# EAGLE design ColorNodeV1 (EAGLE 5.11)
ABBREV: jn5; PROJECT: JeeNode v5
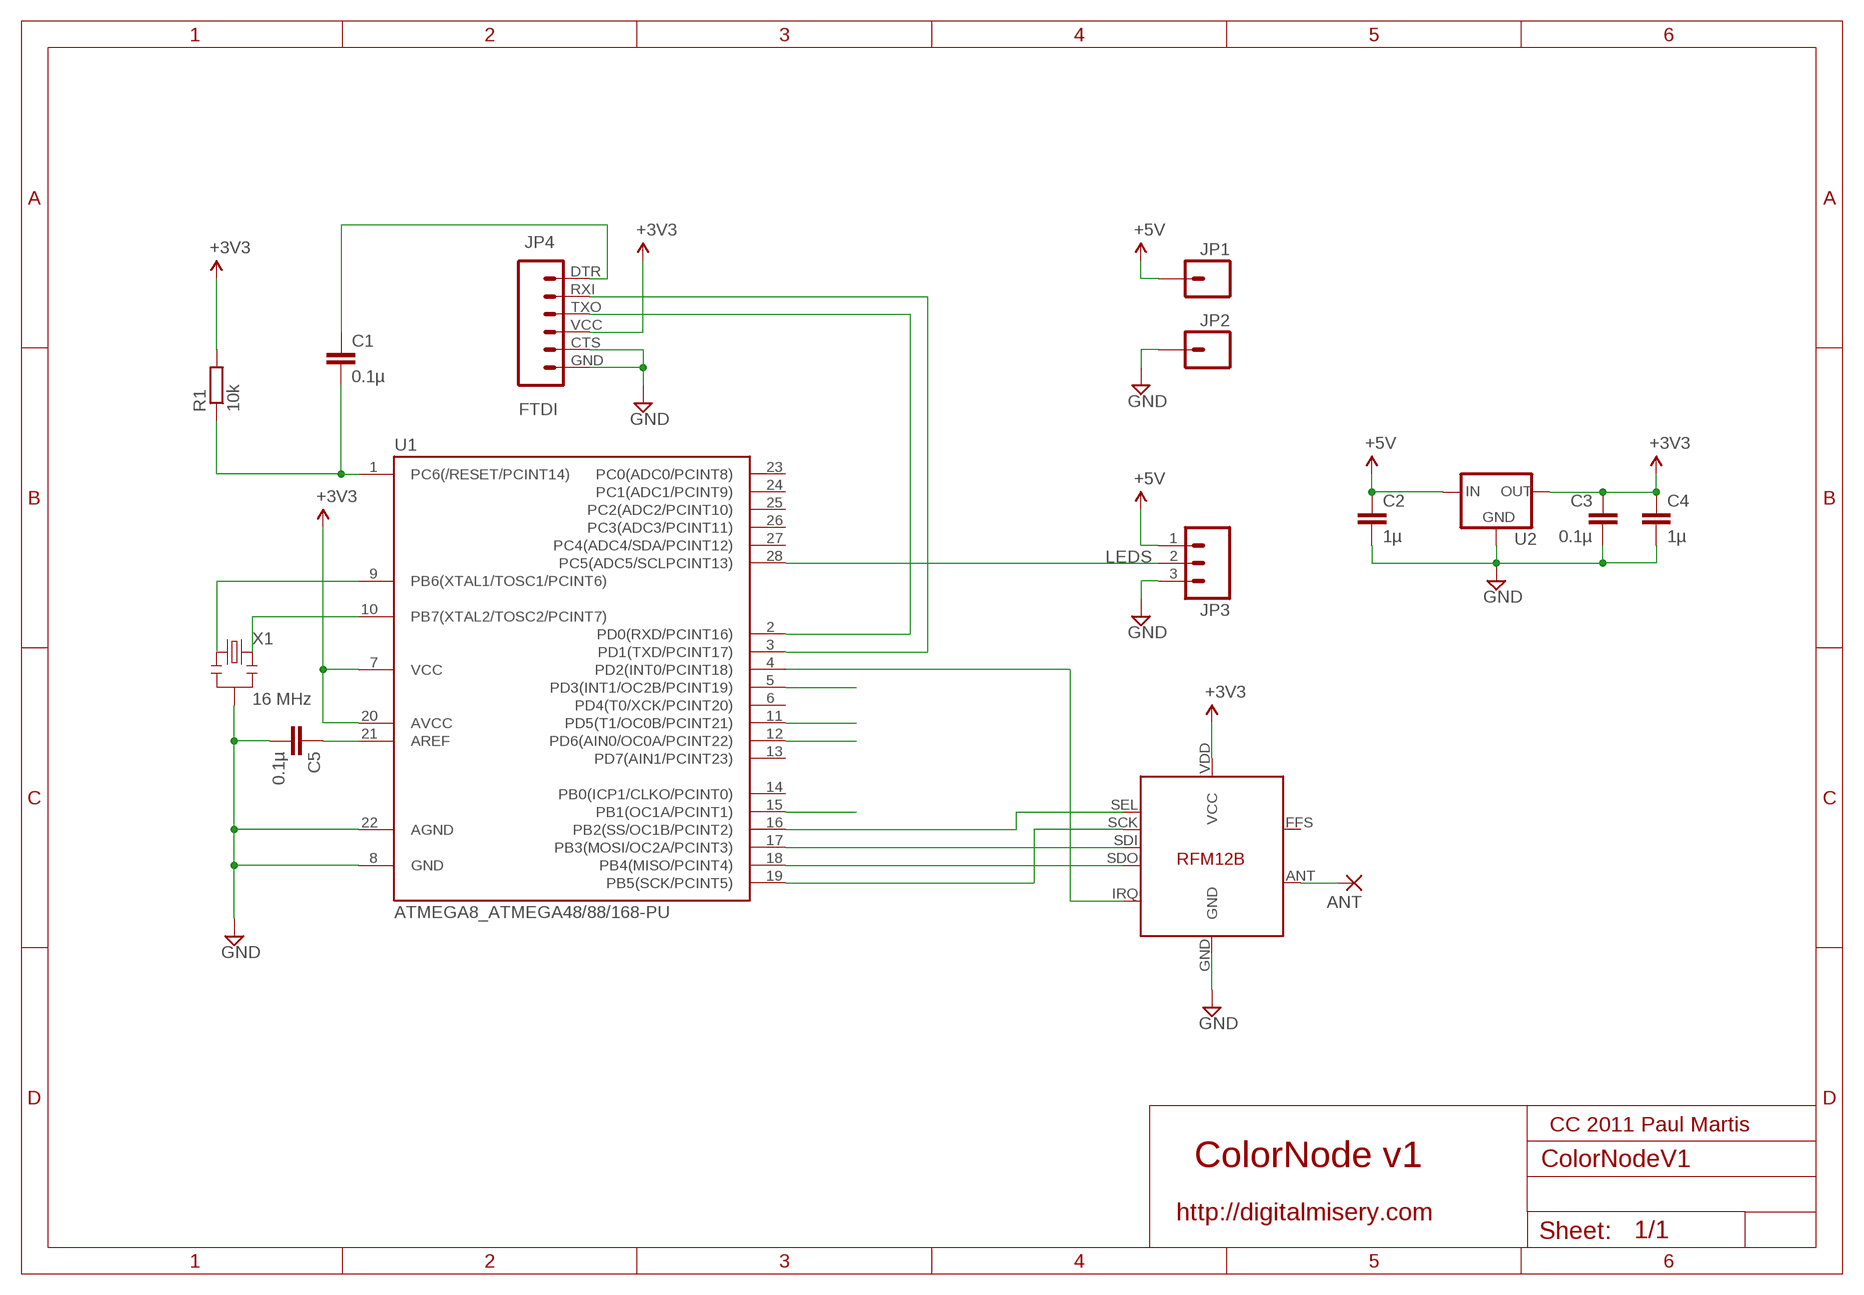
[diagram p0: schematic, sheet 1]

## Parts
ANT  1,6/0,8  [1,6/0,8]
C1  0.1µ  C-EU025-024X044  [C025-024X044]
C2  1µ  C-EU025-024X044  [C025-024X044]
C3  0.1µ  C-EU025-024X044  [C025-024X044]
C4  1µ  C-EU025-024X044  [C025-024X044]
C5  0.1µ  C-EU025-024X044  [C025-024X044]
JP1  M01PTH_2MM  [1X01_2MM]
JP2  M01PTH_2MM  [1X01_2MM]
JP3  M031X03_NO_SILK  [1X03_NO_SILK]
JP4  FTDI  FTDI_BASICPTH  [FTDI_BASIC]
R1  10k  R-EU_0204/7  [0204/7]
U1  ATMEGA8_ATMEGA48/88/168-PU  [ATMEGA8_DIL28-3]
U2  MCP1700INLINE  [TO92-INLINE]
U3  RFM12B  [RFM12B]
X1  16 MHz  RESONATORPTH  [RESONATOR-PTH]

## Nets
5V [power]: C2.1 JP1.1 JP3.1 U2.2(IN) ; supply symbol labelled +5V
GND [power]: C2.2 C3.2 C4.2 C5.2 JP2.1 JP3.3 JP4.CTS JP4.GND U1.8(GND) U1.22(AGND) U2.1(GND) U3.GND X1.2
LEDS: JP3.2 U1.28(PC5(ADC5/SCLPCINT13))
N$1: U1.9(PB6(XTAL1/TOSC1/PCINT6)) X1.1
N$2: C5.1 U1.21(AREF)
N$3: C1.1 JP4.DTR
N$4: U1.5(PD3(INT1/OC2B/PCINT19))
N$5: C1.2 R1.1 U1.1(PC6(/RESET/PCINT14))
N$6: JP4.TXO U1.2(PD0(RXD/PCINT16))
N$7: JP4.RXI U1.3(PD1(TXD/PCINT17))
N$8: U1.11(PD5(T1/OC0B/PCINT21))
N$9: U1.17(PB3(MOSI/OC2A/PCINT3)) U3.SDI
N$10: U1.4(PD2(INT0/PCINT18)) U3.IRQ
N$11: U1.18(PB4(MISO/PCINT4)) U3.SDO
N$12: U1.19(PB5(SCK/PCINT5)) U3.SCK
N$13: ANT.1(P) U3.ANT
N$14: U1.16(PB2(SS/OC1B/PCINT2)) U3.SEL
N$15: U1.12(PD6(AIN0/OC0A/PCINT22))
N$16: U1.15(PB1(OC1A/PCINT1))
N$21: U1.10(PB7(XTAL2/TOSC2/PCINT7)) X1.3
VCC [power]: C3.1 C4.1 JP4.VCC R1.2 U1.7(VCC) U1.20(AVCC) U2.3(OUT) U3.VDD(VCC) ; supply symbol labelled +3V3
Unconnected: U1.6(PD4(T0/XCK/PCINT20)) U1.13(PD7(AIN1/PCINT23)) U1.14(PB0(ICP1/CLKO/PCINT0)) U1.23(PC0(ADC0/PCINT8)) U1.24(PC1(ADC1/PCINT9)) U1.25(PC2(ADC2/PCINT10)) U1.26(PC3(ADC3/PCINT11)) U1.27(PC4(ADC4/SDA/PCINT12)) U3.FFS

## Notes on the sheet
- CC 2011 Paul Martis
- ColorNode v1
- http://digitalmisery.com

## Library data of the parts
ANT = JeeLabs:1,6/0,8: THROUGH-HOLE PAD
C1-C5 = resistor:C-EU: CAPACITOR, European symbol
JP1 JP2 = SparkFun:M01: Header 1 Standard 1-pin 0.1" header. Use with straight break away headers (SKU : PRT-00116), right angle break away headers (PRT-00553), swiss pins (PRT-00743), machine pins (PRT-00117), and female headers (PRT-00115).
JP3 = SparkFun:M03: Header 3 Standard 3-pin 0.1" header. Use with straight break away headers (SKU : PRT-00116), right angle break away headers (PRT-00553), swiss pins (PRT-00743), machine pins (PRT-00117), and female headers (PRT-00115). Molex polarized connector foot print use with SKU : PRT-08232 with associated crimp pins and housings.
JP4 = SparkFun:FTDI_BASIC: FTDI Basic: 3.3V and 5V
R1 = resistor:R-EU_: RESISTOR, European symbol
U1 = jlpcb-105:ATMEGA8_ATMEGA48/88/168-PU
U2 = adafruit:MCP1700: VOLTAGE REGULATOR
U3 = JeeLabs:RFM12B
X1 = SparkFun:RESONATOR: Resonator Small SMD resonator. This is the itty bitty 10/20MHz resonators with built in caps. CSTCE10M0G55 and CSTCE20M0V53. Footprint has been reviewed closely but hasn't been tested yet.

## Net classes
1 power: width 0.381 mm, clearance 0.254 mm

## Board
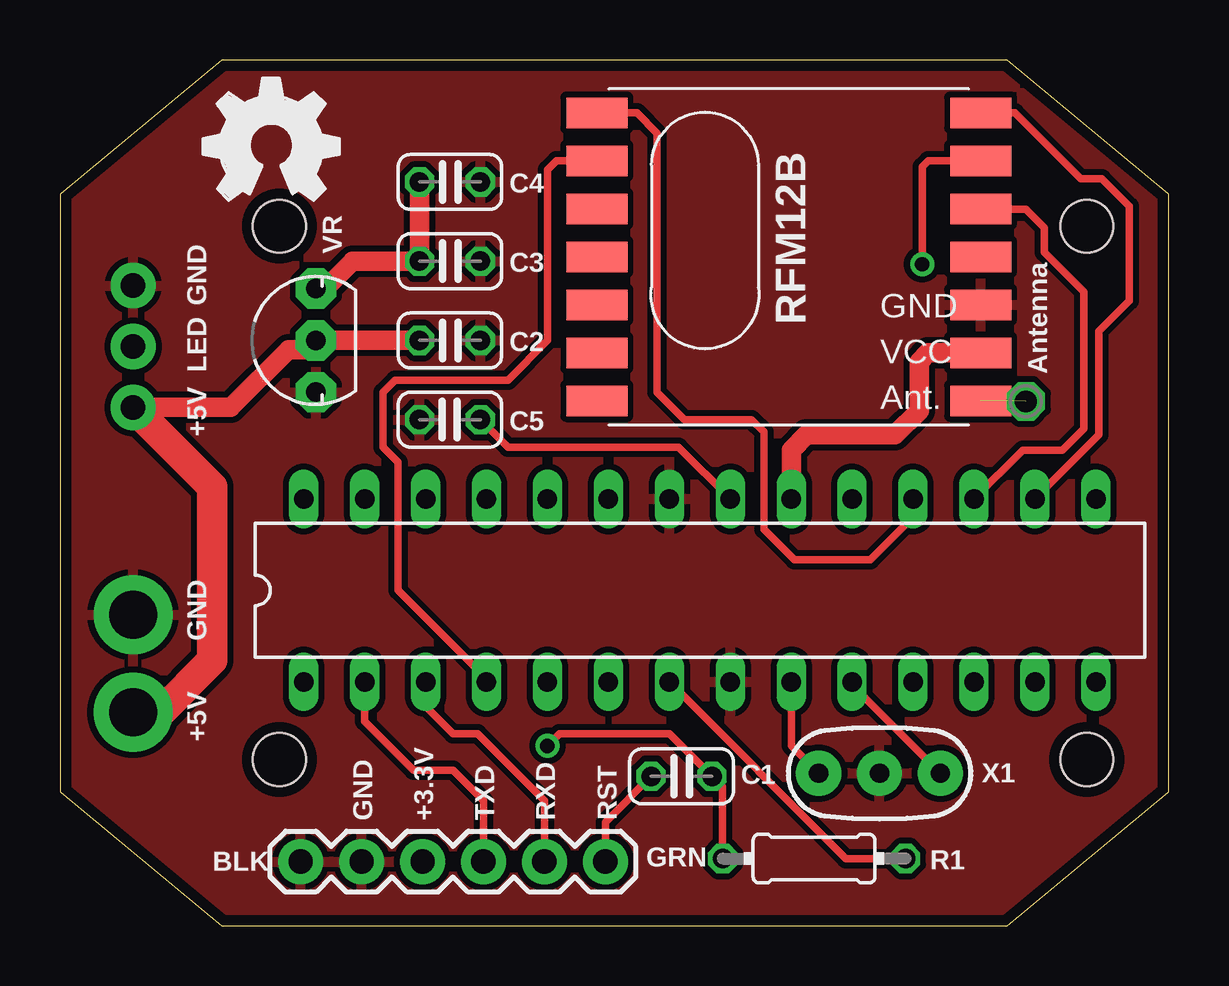
[diagram p1: board, top side]
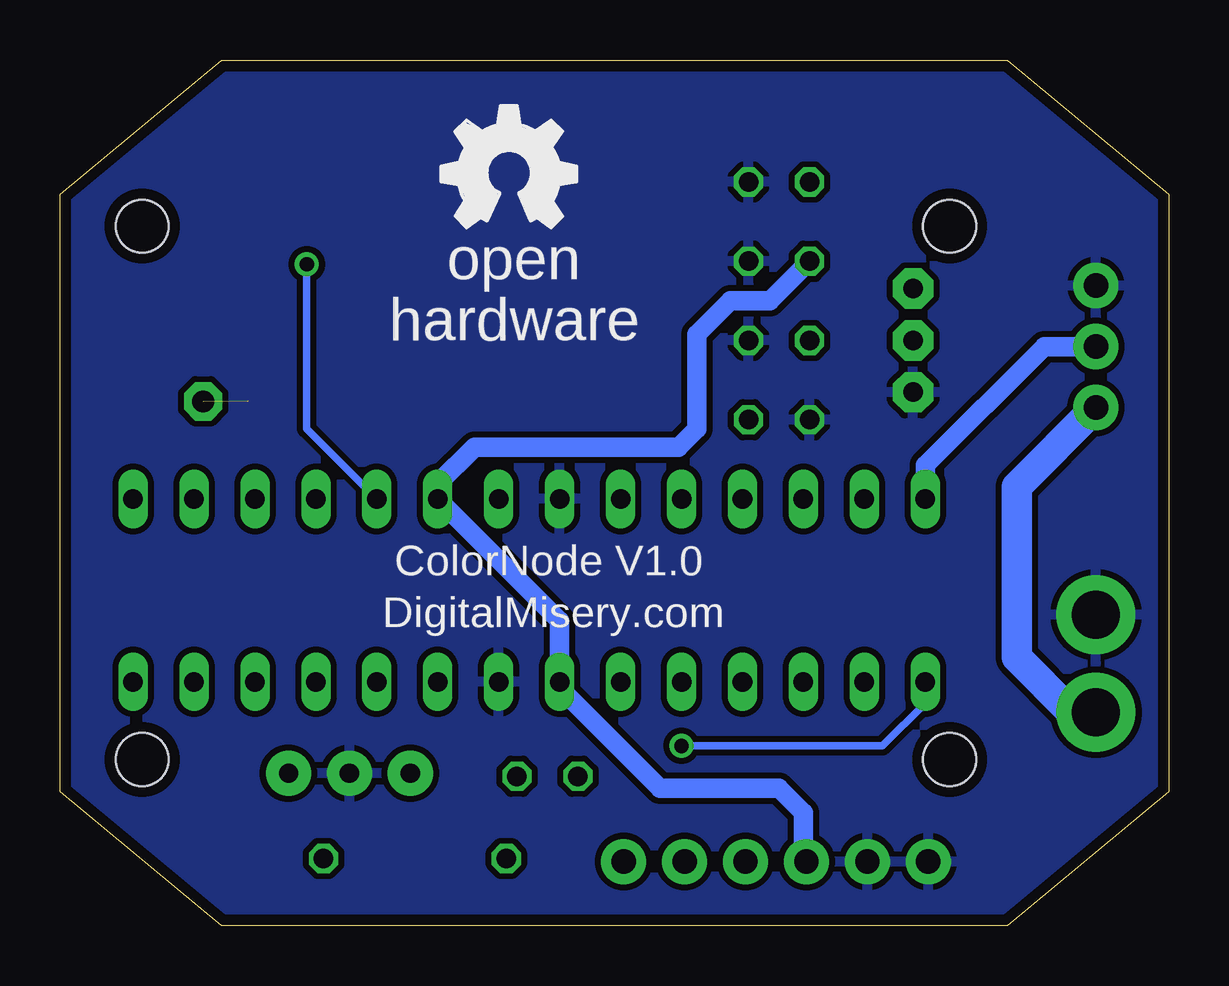
[diagram p2: board, bottom side, seen from below]

Size 46.23 x 36.07 mm. Coordinates in mm from the lower left corner, seen from the top.
Outline: 6.73,0 39.5,0 46.23,5.59 46.23,30.48 39.5,36.07 6.73,36.07 0,30.48 0,5.59 6.73,0
Copper layers (1*16): Top 0.035mm / dielectric 1.5mm / Bottom 0.035mm
Design rules "10mils *": minimum track width 8mil, minimum drill 0.4mm, track to track 8mil, track to pad 8mil, pad to pad 8mil, via to via 8mil, smd to smd 8mil, copper to edge 18mil, drill to drill 0.4mm, minimum pad ring 0.15mm, minimum via ring 8mil, stop-mask expansion 4mil, vias tented up to drill 20mil, thermal gap 10mil
Holes 2.2 mm at 9.14,29.15 9.14,6.92 42.8,6.92 42.8,29.15

### Footprints (pad centres in the part's own frame; a part is rotated, then mirrored left to right if it is on the bottom)
1,6/0,8 = drill 0.9 pad 1.6 octagon: 1 0,0
C025-024X044 = drill 0.813 octagon: 1 -1.27,0; 2 1.27,0
1X01_2MM = drill 2 pad 3.302 round: 1 0,0
1X03_NO_SILK = drill 1.016 pad 1.88 round: 1 0,0; 2 2.54,0; 3 5.08,0
FTDI_BASIC = drill 1.016 pad 1.88 round: CTS 10.16,0; DTR 0,0; GND 12.7,0; RXI 2.54,0; TXO 5.08,0; VCC 7.62,0
0204/7 = drill 0.813 octagon: 1 -3.81,0; 2 3.81,0
ATMEGA8_DIL28-3 = drill 0.813 long: 1 -16.51,-3.81; 2 -13.97,-3.81; 3 -11.43,-3.81; 4 -8.89,-3.81; 5 -6.35,-3.81; 6 -3.81,-3.81; 7 -1.27,-3.81; 8 1.27,-3.81; 9 3.81,-3.81; 10 6.35,-3.81; 11 8.89,-3.81; 12 11.43,-3.81; 13 13.97,-3.81; 14 16.51,-3.81; 15 16.51,3.81; 16 13.97,3.81; 17 11.43,3.81; 18 8.89,3.81; 19 6.35,3.81; 20 3.81,3.81; 21 1.27,3.81; 22 -1.27,3.81; 23 -3.81,3.81; 24 -6.35,3.81; 25 -8.89,3.81; 26 -11.43,3.81; 27 -13.97,3.81; 28 -16.51,3.81
TO92-INLINE = drill 0.813 pad 1.676 octagon: 1 -2.159,0; 2 0,0; 3 2.159,0
RFM12B = smd 2.54 x 1.27: ANT 8,-6; FFS -8,2; GND 8,-2; IRQ -8,4; P$8 -8,0; P$9 -8,-2; P$10 -8,-4; P$12 -8,-6; P$16 8,0; SCK 8,4; SDI 8,2; SDO -8,6; SEL 8,6; VDD 8,-4
RESONATOR-PTH = drill 0.8 pad 1.88 round: 1 -2.54,0; 2 0,0; 3 2.54,0

### Placement (x,y rotation side)
ANT  40.26,21.84 270 top
C1  25.91,6.22 0 top
C2  16.26,24.38 0 top
C3  16.26,27.69 0 top
C4  16.26,30.99 0 top
C5  16.26,21.08 180 top
E$1  [OSHW_FILLX200_NOTEXT]  5.97,30.23 0 top
E$2  [OSHW_FILLX200_NOTEXT]  30.35,29.08 0 bottom
JP1  3.05,8.89 0 top
JP2  3.05,12.95 0 top
JP3  3.05,21.59 90 top
JP4  22.73,2.67 180 top
R1  31.43,2.79 0 top
U1  26.67,13.97 0 top
U2  10.67,24.38 90 top
U3  30.38,27.86 0 top
X1  34.16,6.35 0 top

### Tracks (layer width: path | path; a pad name or v marks a point on that pad's centre or on a via)
5V
  Top 0.813: C2.1 U2.2 10.67,24 9.53,24 7.11,21.59 JP3.1 | 3.05,21.46 3.41,21.83
  Top 1.27: JP1.1 4.19,8.89 6.35,11.05 6.35,18.29 3.17,21.46 3.05,21.46
  Bottom 1.27: JP3.1 6.35,18.29 6.35,11.18 4.06,8.89 JP1.1
GND
  pour Bottom: 0,30.48 6.73,36.07 39.5,36.07 46.23,30.48 46.23,5.59 39.37,0 6.6,0 0,5.59
  pour Top: 0,30.48 6.73,36.07 39.5,36.07 46.23,30.48 46.23,5.59 39.37,0 6.6,0 0,5.59
LEDS
  Bottom 0.813: U1.28 10.16,19.18 5.21,24.13 JP3.2
N$1
  Top 0.305: X1.1 30.48,7.49 U1.9
N$2
  Top 0.305: C5.1 18.67,19.94 25.78,19.94 U1.21
N$3
  Top 0.305: JP4.DTR 22.73,4.32 C1.1
N$5  (via drill 0.6)
  Top 0.305: R1.1 27.62,5.78 C1.2 25.4,8 20.83,8 v20.32,7.49
  Bottom 0.305: U1.1 10.16,9.27 11.94,7.49 v20.32,7.49
N$6
  Top 0.305: JP4.TXO 17.65,5.21 16.38,6.48 14.73,6.48 12.7,8.51 U1.2
N$7
  Top 0.305: JP4.RXI 20.19,5.21 17.4,8 16.38,8 15.24,9.14 U1.3
N$9
  Top 0.305: U3.SDI 38.4,29.84 40.26,29.84 41.02,29.08 41.02,28.07 42.67,26.42 42.67,20.7 41.78,19.81 40.13,19.81 U1.17
N$10
  Top 0.305: U3.IRQ 20.69,31.86 20.32,31.5 20.32,24.38 18.67,22.73 13.97,22.73 13.46,22.23 13.46,19.94 14.1,19.3 14.1,13.97 17.78,10.29 U1.4
N$11
  Top 0.305: U1.18 35.56,17.02 33.78,15.24 30.61,15.24 29.34,16.51 29.34,20.57 28.83,21.08 26.04,21.08 24.89,22.23 24.89,33.02 24.05,33.86 U3.SDO
N$12  (via drill 0.6)
  Top 0.305: U3.SCK 38.37,31.88 36.2,31.88 35.94,31.62 v35.94,27.56
  Bottom 0.305: U1.19 35.94,20.7 v35.94,27.56
N$13  (1 unrouted)
N$14
  Top 0.305: U1.16 43.31,20.45 43.31,24.77 44.58,26.04 44.58,29.97 43.43,31.11 42.55,31.11 39.8,33.86 U3.SEL
N$21
  Top 0.305: X1.3 33.02,10.03 U1.10
VCC
  Top 0.305: R1.2 32.77,2.79 U1.7
  Top 0.813: U1.20 30.48,19.81 31.11,20.45 34.8,20.45 35.81,21.46 35.81,23.5 36.18,23.86 U3.VDD | C4.1 C3.1 12.19,27.69 11.05,26.54 U2.3
  Bottom 0.813: C3.1 16.64,26.04 18.29,26.04 19.68,24.64 19.68,20.7 20.45,19.94 28.96,19.94 30.48,18.41 U1.20 25.4,12.7 U1.7 25.4,9.91 21.21,5.71 16.26,5.71 15.24,4.7 15.24,2.79 JP4.VCC

### Text on the board
tPlace: Antenna | RST
bPlace: open | hardware | ColorNode V1.0 | DigitalMisery.com
tNames: RFM12B | C4 | VR | C3 | GND | C2 | LED | C5 | +5V | GND | +5V | C1 | X1 | GND | +3.3V | TXD | RXD | BLK | GRN | R1